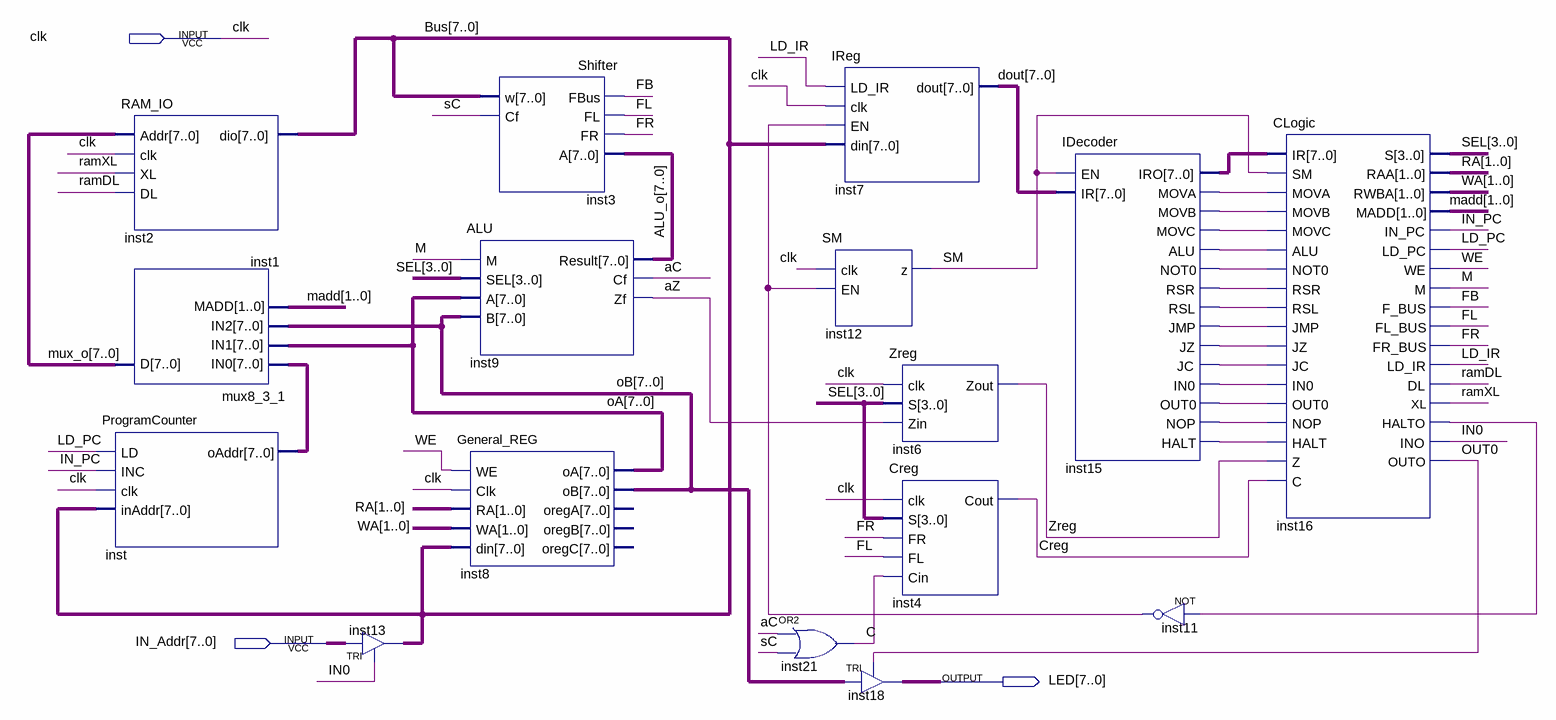
[diagram p0: schematic sheet]
// Quartus schematic myCPU.bdf as structural Verilog: 16 symbols, 3 pins
module myCPU (
  input  clk,
  input  [7:0] IN_Addr,
  output [7:0] LED
);

  wire aC, aZ, C, Creg, FB, FL, FR, IN0, IN_PC, inst11_out, inst15_alu, inst15_halt, inst15_in0, inst15_jc,
       inst15_jmp, inst15_jz, inst15_mova, inst15_movb, inst15_movc, inst15_nop, inst15_not0, inst15_out0,
       inst15_rsl, inst15_rsr, inst16_halto, LD_IR, LD_PC, M, OUT0, ramDL, ramXL, sC, SM, WE, Zreg;
  wire [1:0] madd, RA, WA;
  wire [3:0] SEL;
  wire [7:0] ALU_o, Bus, dout, inst15_iro, inst_oaddr, mux_o, oA, oB;

  RAM_IO inst2 (.Addr(mux_o), .clk(clk), .XL(ramXL), .DL(ramDL), .dio(Bus));
  mux8_3_1 inst1 (.IN0(inst_oaddr), .IN1(oA), .IN2(oB), .MADD(madd), .D(mux_o));
  ProgramCounter inst (.LD(LD_PC), .INC(IN_PC), .clk(clk), .inAddr(Bus), .oAddr(inst_oaddr));
  TRI inst13[7:0] (.IN(IN_Addr), .OE(IN0), .OUT(Bus));
  Shifter inst3 (.FBus(FB), .FL(FL), .FR(FR), .A(ALU_o), .w(Bus), .Cf(sC));
  ALU inst9 (.M(M), .SEL(SEL), .A(oA), .B(oB), .Result(ALU_o), .Cf(aC), .Zf(aZ));
  General_REG inst8 (.WE(WE), .Clk(clk), .RA(RA), .WA(WA), .din(Bus), .oA(oA), .oB(oB));  // open: oregA, oregB, oregC
  SM inst12 (.clk(clk), .EN(inst11_out), .z(SM));
  or inst21 (C, aC, sC);
  IReg inst7 (.LD_IR(LD_IR), .clk(clk), .EN(inst11_out), .din(Bus), .dout(dout));
  Zreg inst6 (.clk(clk), .S(SEL), .Zin(aZ), .Zout(Zreg));
  Creg inst4 (.clk(clk), .S(SEL), .FR(FR), .FL(FL), .Cin(C), .Cout(Creg));
  TRI inst18[7:0] (.IN(oB), .OE(OUT0), .OUT(LED));
  IDecoder inst15 (
    .EN(SM), .IR(dout), .IRO(inst15_iro), .MOVA(inst15_mova), .MOVB(inst15_movb), .MOVC(inst15_movc),
    .ALU(inst15_alu), .NOT0(inst15_not0), .RSR(inst15_rsr), .RSL(inst15_rsl), .JMP(inst15_jmp),
    .JZ(inst15_jz), .JC(inst15_jc), .IN0(inst15_in0), .OUT0(inst15_out0), .NOP(inst15_nop), .HALT(inst15_halt));
  not inst11 (inst11_out, inst16_halto);
  CLogic inst16 (
    .IR(inst15_iro), .SM(SM), .MOVA(inst15_mova), .MOVB(inst15_movb), .MOVC(inst15_movc), .ALU(inst15_alu),
    .NOT0(inst15_not0), .RSR(inst15_rsr), .RSL(inst15_rsl), .JMP(inst15_jmp), .JZ(inst15_jz), .JC(inst15_jc),
    .IN0(inst15_in0), .OUT0(inst15_out0), .NOP(inst15_nop), .HALT(inst15_halt), .Z(Zreg), .C(Creg), .S(SEL),
    .RAA(RA), .RWBA(WA), .MADD(madd), .IN_PC(IN_PC), .LD_PC(LD_PC), .WE(WE), .M(M), .F_BUS(FB), .FL_BUS(FL),
    .FR_BUS(FR), .LD_IR(LD_IR), .DL(ramDL), .XL(ramXL), .HALTO(inst16_halto), .INO(IN0), .OUTO(OUT0));
endmodule
